# Altium project drumsticks.PrjPcb
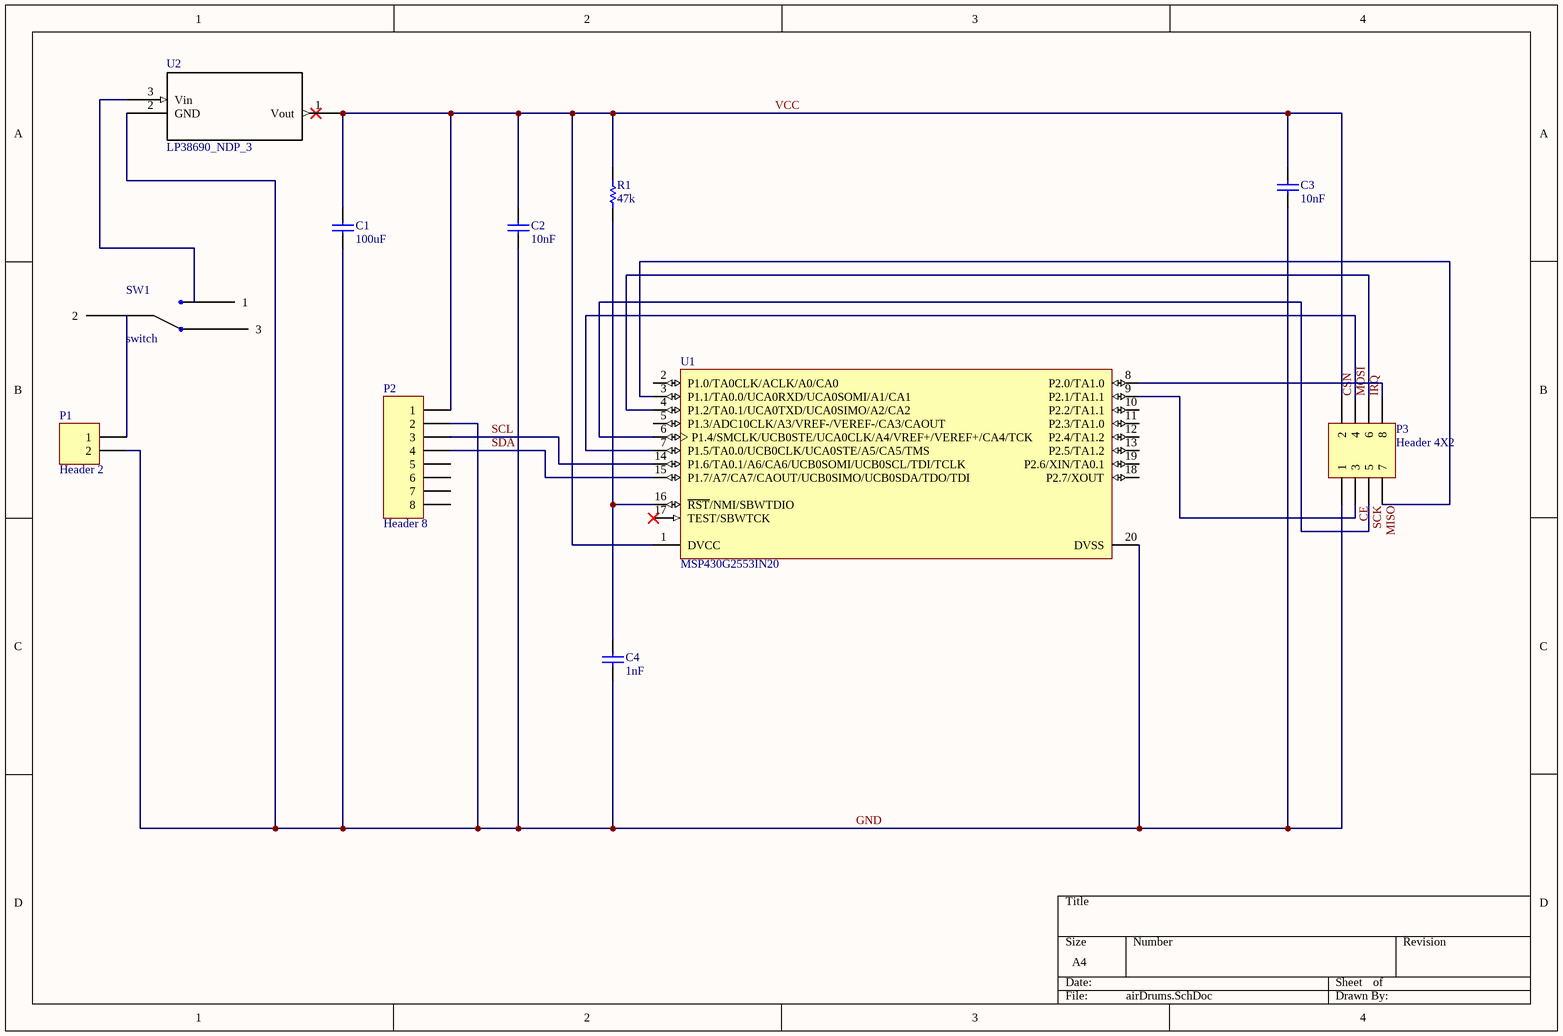
[diagram p0: airDrums.SchDoc]
1 sheet, 11 parts. Net scope: global (net labels, ports and power ports of the same name join across sheets).
Board file: airDrums3.PcbDoc

## Sheet airDrums.SchDoc
size A4

### Parts
C1  100uF  [CAPC6032X28N]
C2  10nF  [CAP0805]
C3  10nF  [CAP0805]
C4  1nF  [CAP0805]
P1  Header 2  [HDR1X2]
P2  Header 8  [HDR1X8]
P3  Header 4X2  [HDR2X4]
R1  47k  [CAP0805]
SW1  switch  [Switch]
U1  MSP430G2553IN20  [TI-N20]
U2  LP38690_NDP_3  [TD03B]

### Nets
CE: P3.3 U1.9(P2.1/TA1.1)
CSN: P3.4 U1.7(P1.5/TA0.0/UCB0CLK/UCA0STE/A5/CA5/TMS)
GND: C1.1 C2.1 C3.1 C4.1 P1.2 P2.2 P3.1 U1.20(DVSS) U2.2(GND)
IRQ: P3.8 U1.8(P2.0/TA1.0)
MISO: P3.7 U1.3(P1.1/TA0.0/UCA0RXD/UCA0SOMI/A1/CA1)
MOSI: P3.6 U1.4(P1.2/TA0.1/UCA0TXD/UCA0SIMO/A2/CA2)
SCK: P3.5 U1.6(P1.4/SMCLK/UCB0STE/UCA0CLK/A4/VREF+/VEREF+/CA4/TCK)
SCL: P2.3 U1.14(P1.6/TA0.1/A6/CA6/UCB0SOMI/UCB0SCL/TDI/TCLK)
SDA: P2.4 U1.15(P1.7/A7/CA7/CAOUT/UCB0SIMO/UCB0SDA/TDO/TDI)
VCC: C1.2 C2.2 C3.2 P2.1 P3.2 R1.2 U1.1(DVCC) U2.1(Vout)
NetC4_2: C4.2 R1.1 U1.16(~{RST}/NMI/SBWTDIO)
NetP1_1: P1.1 SW1.2
NetSW1_1: SW1.1 U2.3(Vin)

Not connected (* = marked no-connect by the designer): P2 5 6 7 8; SW1 3; U1 2(P1.0/TA0CLK/ACLK/A0/CA0) 5(P1.3/ADC10CLK/A3/VREF-/VEREF-/CA3/CAOUT) 10(P2.2/TA1.1) 11(P2.3/TA1.0) 12(P2.4/TA1.2) 13(P2.5/TA1.2) 17(TEST/SBWTCK)* 18(P2.7/XOUT) 19(P2.6/XIN/TA0.1)

### Library data of the parts
C1-C4 = Cap Semi: Capacitor (Semiconductor SIM Model); Published: 8-Jun-2000; LatestRevisionDate: 29-May-2009; LatestRevisionNote: IPC-7351 Footprint Added.; PackageReference: C1206; Publisher: Altium Limited; PackageDescription: Chip Capacitor
  C1: Value: 100uF
  C2 C3: Value: 10nF
  C4: Value: 1nF
P1 = Header 2: Header, 2-Pin; LatestRevisionDate: 17-Jul-2002; LatestRevisionNote: Re-released for DXP Platform.; Publisher: Altium Limited
P2 = Header 8: Header, 8-Pin; LatestRevisionDate: 17-Jul-2002; LatestRevisionNote: Re-released for DXP Platform.; Publisher: Altium Limited
P3 = Header 4X2: Header, 4-Pin, Dual row; LatestRevisionDate: 17-Jul-2002; LatestRevisionNote: Re-released for DXP Platform.; Publisher: Altium Limited
R1 = Res Semi: Semiconductor Resistor; Published: 8-Jun-2000; LatestRevisionDate: 17-Jul-2002; LatestRevisionNote: Re-released for DXP Platform.; PackageReference: AXIAL-0.5; Publisher: Altium Limited; PackageDescription: Axial Device, Thru-Hole; 2 Leads; 0.5 in Pin Spacing; Value: 47K
U1 = MSP430G2553IN20: 16 MHz Mixed Signal Microcontroller with 16 KB Flash, 512 B SRAM and 24 GPIOs, -40 to 85 degC, 20-pin DIP (N), Pb-Free (RoHS); Manufacturer: Texas Instruments; ADC: 10-bit SAR; ADC Channels: 8; Brown Out Reset: Yes; Flash(KB): 16; GPIO: 24; SRAM(B): 512; SubFamily: Value Line; Timers - 16-bit: 2; USCI_A (UART/LIN/IrDA/SPI): 1; DatasheetVersion: SLAS735G; PackageVersion: 4040049/E; PackageReference: N20; PackageDescription: 20-Pin Plastic In-Line, Body 25.40 x 6.35 mm, Pitch 2.54 mm; Supplier 1: Digi-Key; Supplier Part Number 1: MSP430G2533IRHB32T-ND; Supplier 2: Mouser; Supplier Part Number 2: 595-P430G2533IRHB32T; Cap touch I/O: Yes; Comparators: Yes; Eco-Plan: Pb-Free (RoHS); Frequency(MHz): 16; Temp Sensor: Yes; USCI_B (I2C & SPI): 1; Watchdog: Yes; Mounting Technology: Through Hole; Code_JEDEC: MS-001; PartNumber: MSP430G2553IN20; ComponentLink1Description: Manufacturer URL; ComponentLink1URL: http://www.ti.com/; ComponentLink2Description: Datasheet; ComponentLink2URL: http://www.ti.com/general/docs/lit/getliterature.tsp?genericPartNumber=MSP430G2553&fileType=pdf; ComponentLink3Description: Package Specification; ComponentLink3URL: http://www.ti.com/litv/pdf/mpds177g
U2 = LP38690_NDP_3: Imported; PartNumber: LP38690DT-18; Comp: TypeLDO; Vendor: NationalSemiconductor; Symbol: NameLP38690DT-18; Library: ReferenceLP38690DT; Type: DEV; Version: 1; base_pn: LP38690; Pin: Count3; RefDes: RefDes; Value: Value